# Altium schematic sheet PIC32Square.SchDoc
size A
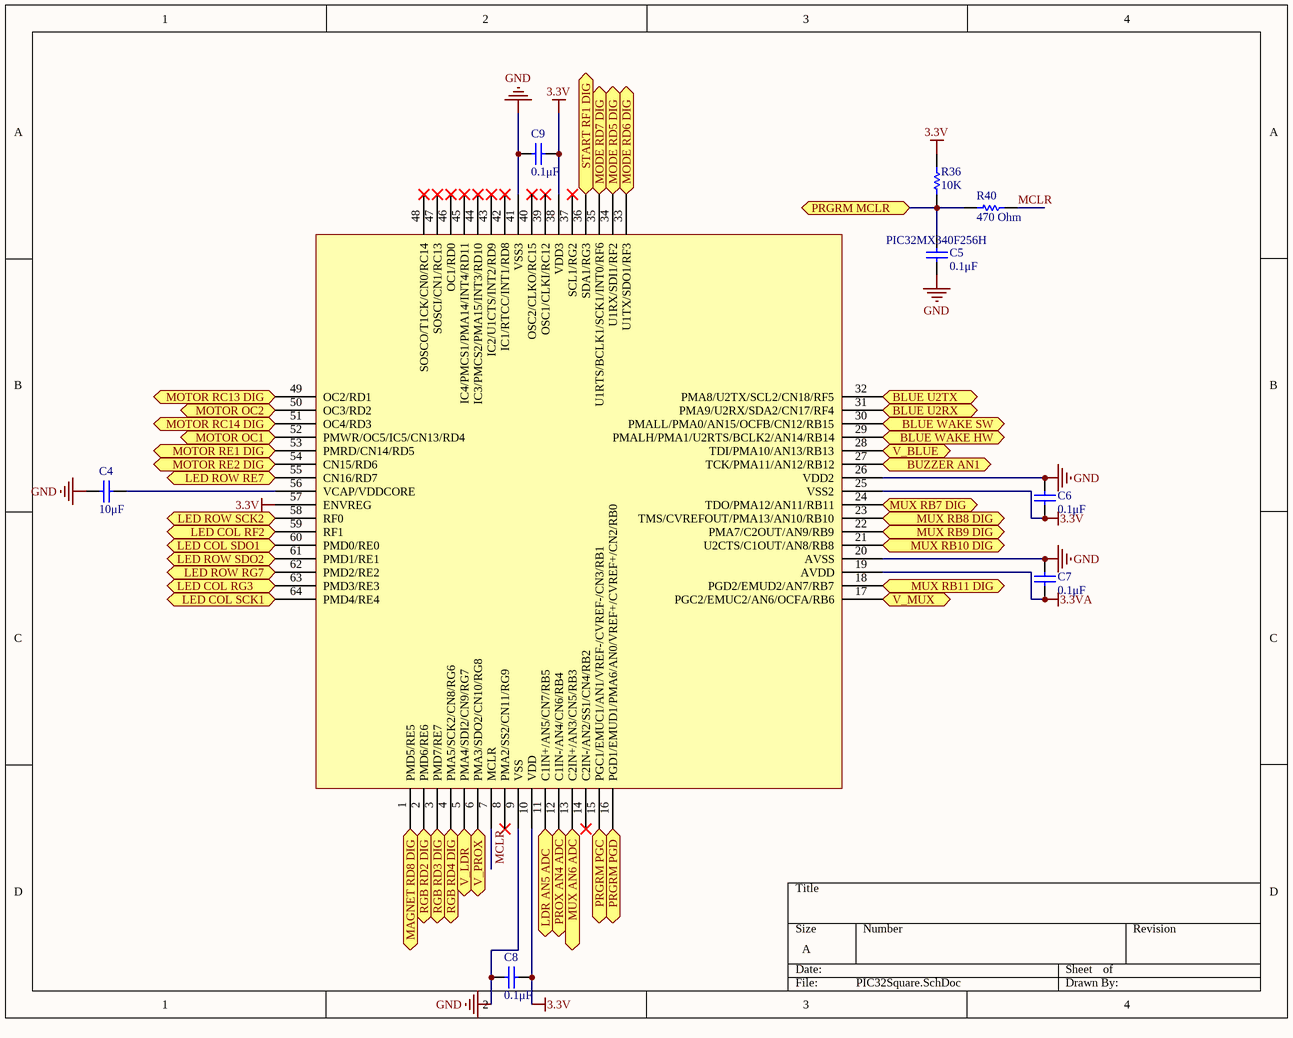
[diagram p0: PIC32Square.SchDoc]

## Parts
C4  10μF  [Capacitor]
C5  0.1μF  [Capacitor]
C6  0.1μF  [Capacitor]
C7  0.1μF  [Capacitor]
C8  0.1μF  [Capacitor]
C9  0.1μF  [Capacitor]
PIC32Square  PIC32MX340F256H  [PIC32]
R36  10K  [Resistor0603]
R40  470 Ohm  [Resistor0603]

## Ports
BLUE U2RX, BLUE U2TX, BLUE WAKE HW, BLUE WAKE SW, BUZZER AN1, LDR AN5 ADC, LED COL RF2, LED COL RG3, LED COL SCK1, LED COL SDO1, LED ROW RE7, LED ROW RG7, LED ROW SCK2, LED ROW SDO2, MAGNET RD8 DIG, MODE RD5 DIG, MODE RD6 DIG, MODE RD7 DIG, MOTOR OC1, MOTOR OC2, MOTOR RC13 DIG, MOTOR RC14 DIG, MOTOR RE1 DIG, MOTOR RE2 DIG, MUX AN6 ADC, MUX RB7 DIG, MUX RB8 DIG, MUX RB9 DIG, MUX RB10 DIG, MUX RB11 DIG, PRGRM MCLR, PRGRM PGC, PRGRM PGD, PROX AN4 ADC, RGB RD2 DIG, RGB RD3 DIG, RGB RD4 DIG, START RF1 DIG, V_BLUE, V_LDR, V_MUX, V_PROX

## Nets
3.3V: C6.1 C8.1 C9.2 PIC32Square.10(VDD) PIC32Square.25(VSS2) PIC32Square.38(VDD3) PIC32Square.57(ENVREG) R36.2
3.3VA: C7.1 PIC32Square.19(AVDD)
GND: C4.2 C5.2 C6.2 C7.2 C8.2 C9.1 PIC32Square.9(VSS) PIC32Square.20(AVSS) PIC32Square.26(VDD2) PIC32Square.41(VSS3)
BLUE U2RX: PIC32Square.31(PMA9/U2RX/SDA2/CN17/RF4) ; port BLUE U2RX
BLUE U2TX: PIC32Square.32(PMA8/U2TX/SCL2/CN18/RF5) ; port BLUE U2TX
BLUE WAKE HW: PIC32Square.29(PMALH/PMA1/U2RTS/BCLK2/AN14/RB14) ; port BLUE WAKE HW
BLUE WAKE SW: PIC32Square.30(PMALL/PMA0/AN15/OCFB/CN12/RB15) ; port BLUE WAKE SW
BUZZER AN1: PIC32Square.27(TCK/PMA11/AN12/RB12) ; port BUZZER AN1
LDR AN5 ADC: PIC32Square.11(C1IN+/AN5/CN7/RB5) ; port LDR AN5 ADC
LED COL RF2: PIC32Square.59(RF1) ; port LED COL RF2
LED COL RG3: PIC32Square.63(PMD3/RE3) ; port LED COL RG3
LED COL SCK1: PIC32Square.64(PMD4/RE4) ; port LED COL SCK1
LED COL SDO1: PIC32Square.60(PMD0/RE0) ; port LED COL SDO1
LED ROW RE7: PIC32Square.55(CN16/RD7) ; port LED ROW RE7
LED ROW RG7: PIC32Square.62(PMD2/RE2) ; port LED ROW RG7
LED ROW SCK2: PIC32Square.58(RF0) ; port LED ROW SCK2
LED ROW SDO2: PIC32Square.61(PMD1/RE1) ; port LED ROW SDO2
MAGNET RD8 DIG: PIC32Square.1(PMD5/RE5) ; port MAGNET RD8 DIG
MCLR: PIC32Square.7(MCLR) R40.1
MODE RD5 DIG: PIC32Square.34(U1RX/SDI1/RF2) ; port MODE RD5 DIG
MODE RD6 DIG: PIC32Square.33(U1TX/SDO1/RF3) ; port MODE RD6 DIG
MODE RD7 DIG: PIC32Square.35(U1RTS/BCLK1/SCK1/INT0/RF6) ; port MODE RD7 DIG
MOTOR OC1: PIC32Square.52(PMWR/OC5/IC5/CN13/RD4) ; port MOTOR OC1
MOTOR OC2: PIC32Square.50(OC3/RD2) ; port MOTOR OC2
MOTOR RC13 DIG: PIC32Square.49(OC2/RD1) ; port MOTOR RC13 DIG
MOTOR RC14 DIG: PIC32Square.51(OC4/RD3) ; port MOTOR RC14 DIG
MOTOR RE1 DIG: PIC32Square.53(PMRD/CN14/RD5) ; port MOTOR RE1 DIG
MOTOR RE2 DIG: PIC32Square.54(CN15/RD6) ; port MOTOR RE2 DIG
MUX AN6 ADC: PIC32Square.13(C2IN+/AN3/CN5/RB3) ; port MUX AN6 ADC
MUX RB7 DIG: PIC32Square.24(TDO/PMA12/AN11/RB11) ; port MUX RB7 DIG
MUX RB8 DIG: PIC32Square.23(TMS/CVREFOUT/PMA13/AN10/RB10) ; port MUX RB8 DIG
MUX RB9 DIG: PIC32Square.22(PMA7/C2OUT/AN9/RB9) ; port MUX RB9 DIG
MUX RB10 DIG: PIC32Square.21(U2CTS/C1OUT/AN8/RB8) ; port MUX RB10 DIG
MUX RB11 DIG: PIC32Square.18(PGD2/EMUD2/AN7/RB7) ; port MUX RB11 DIG
PRGRM MCLR: C5.1 R36.1 R40.2 ; port PRGRM MCLR
PRGRM PGC: PIC32Square.15(PGC1/EMUC1/AN1/VREF-/CVREF-/CN3/RB1) ; port PRGRM PGC
PRGRM PGD: PIC32Square.16(PGD1/EMUD1/PMA6/AN0/VREF+/CVREF+/CN2/RB0) ; port PRGRM PGD
PROX AN4 ADC: PIC32Square.12(C1IN-/AN4/CN6/RB4) ; port PROX AN4 ADC
RGB RD2 DIG: PIC32Square.2(PMD6/RE6) ; port RGB RD2 DIG
RGB RD3 DIG: PIC32Square.3(PMD7/RE7) ; port RGB RD3 DIG
RGB RD4 DIG: PIC32Square.4(PMA5/SCK2/CN8/RG6) ; port RGB RD4 DIG
START RF1 DIG: PIC32Square.36(SDA1/RG3) ; port START RF1 DIG
V_BLUE: PIC32Square.28(TDI/PMA10/AN13/RB13) ; port V_BLUE
V_LDR: PIC32Square.5(PMA4/SDI2/CN9/RG7) ; port V_LDR
V_MUX: PIC32Square.17(PGC2/EMUC2/AN6/OCFA/RB6) ; port V_MUX
V_PROX: PIC32Square.6(PMA3/SDO2/CN10/RG8) ; port V_PROX
NetC4_1: C4.1 PIC32Square.56(VCAP/VDDCORE)

Not connected (* = marked no-connect by the designer): PIC32Square 8(PMA2/SS2/CN11/RG9)* 14(C2IN-/AN2/SS1/CN4/RB2)* 37(SCL1/RG2)* 39(OSC1/CLKI/RC12)* 40(OSC2/CLKO/RC15)* 42(IC1/RTCC/INT1/RD8)* 43(IC2/U1CTS/INT2/RD9)* 44(IC3/PMCS2/PMA15/INT3/RD10)* 45(IC4/PMCS1/PMA14/INT4/RD11)* 46(OC1/RD0)* 47(SOSCI/CN1/RC13)* 48(SOSCO/T1CK/CN0/RC14)*

## Library data of the parts
C4-C9 = Cap: Capacitor; Published: 8-Jun-2000; LatestRevisionDate: 17-Jul-2002; LatestRevisionNote: Re-released for DXP Platform.; PackageReference: RAD-0.3; Publisher: Altium Limited; PackageDescription: Radial Cap, Thru-Hole; 2 Leads; 0.3 in Pin Spacing
  C4: Value: 10μF
  C5-C9: Value: 0.1μF
PIC32Square = PIC32square: Farnell Reference: 1523322
R36 R40 = Res1: Resistor; Published: 8-Jun-2000; LatestRevisionDate: 17-Jul-2002; LatestRevisionNote: Re-released for DXP Platform.; PackageReference: AXIAL-0.3; Publisher: Altium Limited; PackageDescription: Axial Device, Thru-Hole; 2 Leads; 0.3 in Pin Spacing
  R36: Value: 10K
  R40: Value: 470 Ohm